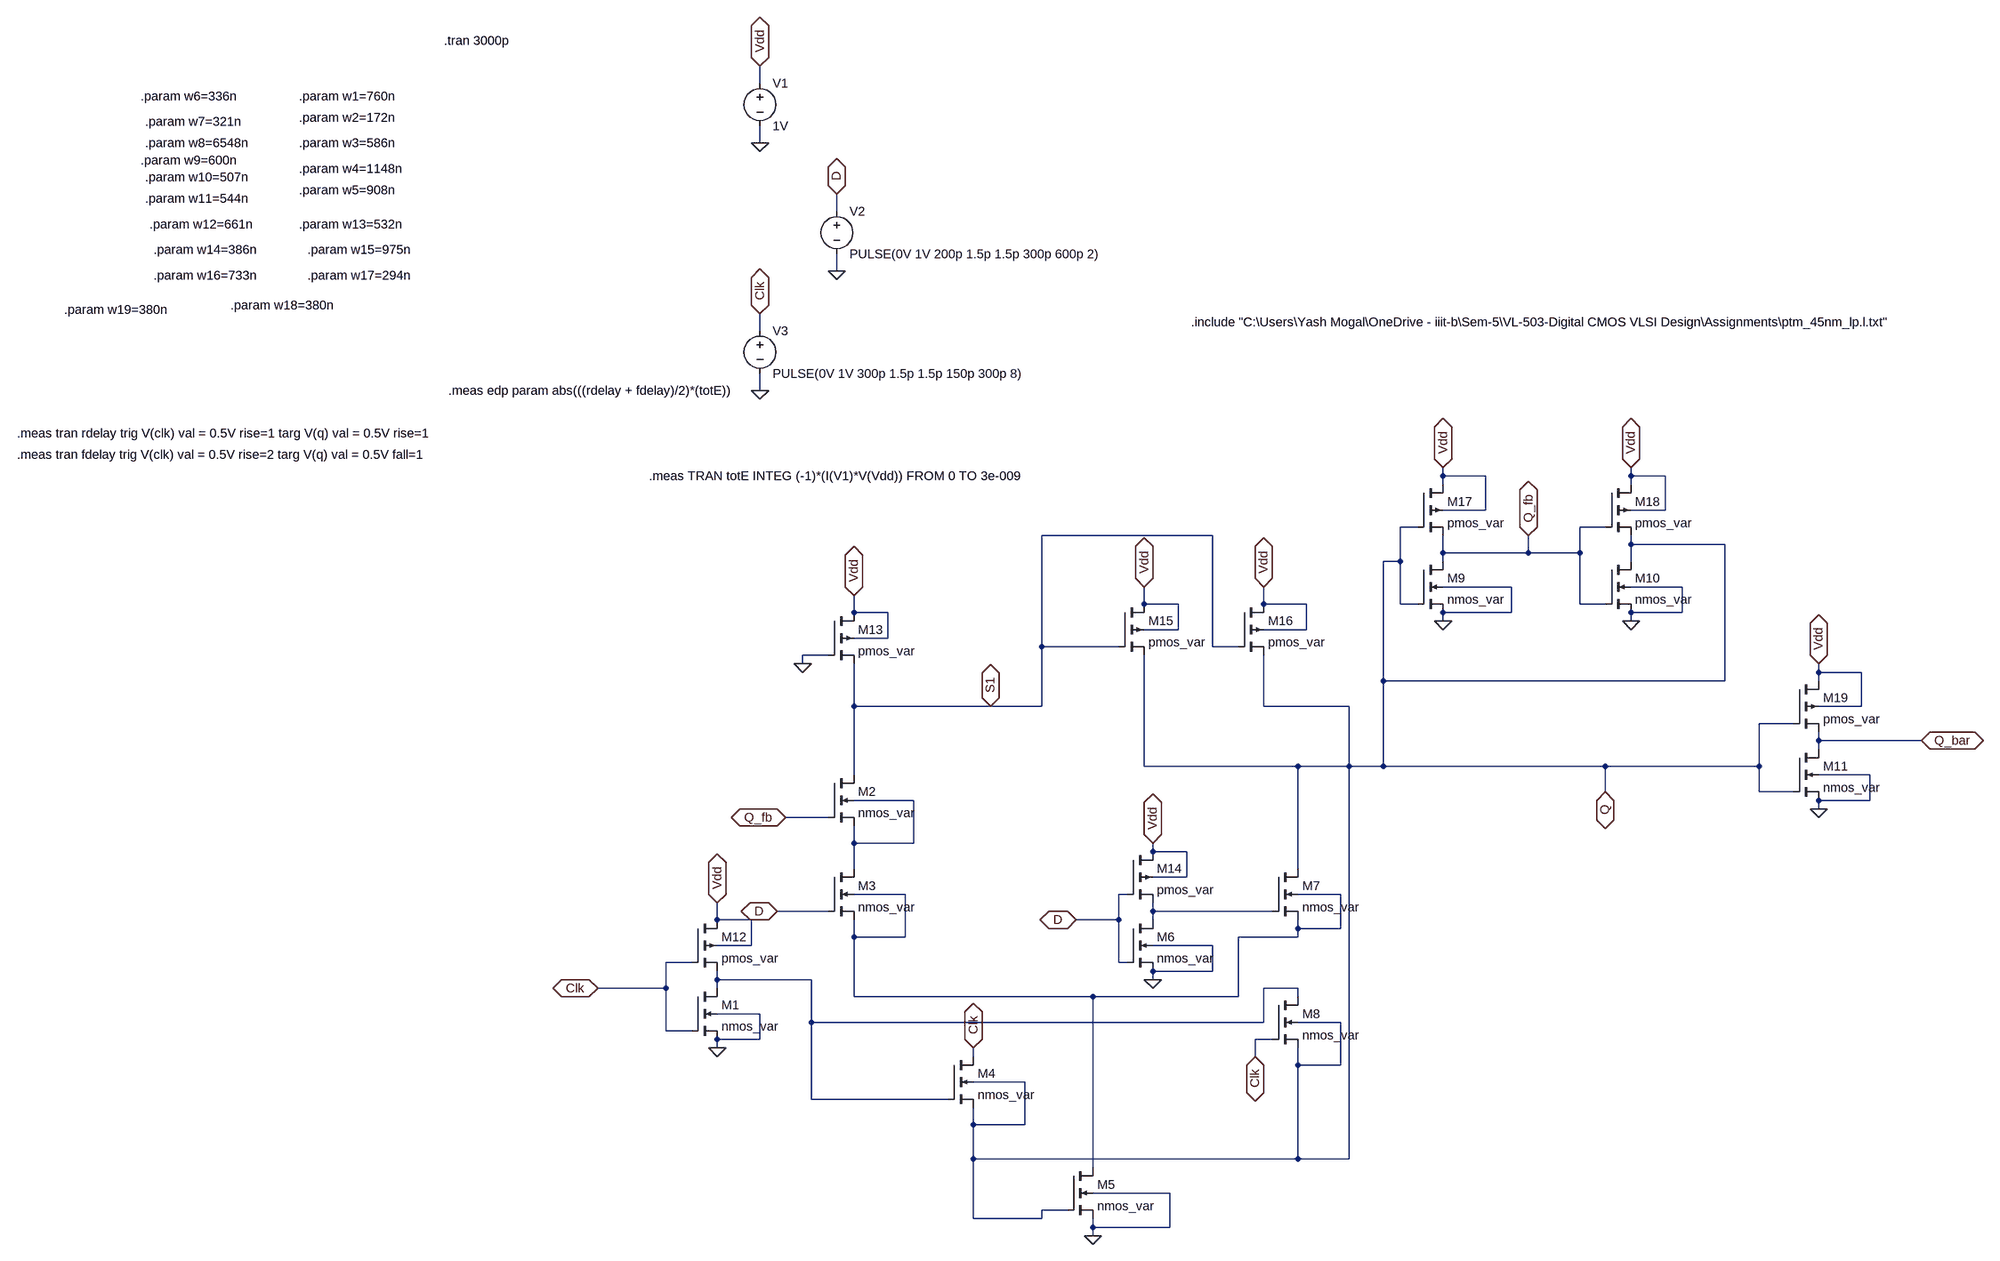
[diagram p0: schematic Project_CEPFF.asc]
Project_CEPFF.asc, the LTspice schematic file:
Version 4
SHEET 1 2164 680
WIRE -144 -1664 -144 -1696
WIRE -144 -1552 -144 -1584
WIRE 0 -1424 0 -1456
WIRE 0 -1312 0 -1344
WIRE -144 -1200 -144 -1232
WIRE -144 -1088 -144 -1120
WIRE 1136 -928 1136 -944
WIRE 1216 -928 1136 -928
WIRE 1488 -928 1488 -944
WIRE 1552 -928 1488 -928
WIRE 1136 -912 1136 -928
WIRE 1488 -912 1488 -928
WIRE 1216 -864 1216 -928
WIRE 1216 -864 1136 -864
WIRE 1552 -864 1552 -928
WIRE 1552 -864 1488 -864
WIRE 1088 -832 1056 -832
WIRE 1440 -832 1392 -832
WIRE 704 -816 384 -816
WIRE 1488 -800 1488 -816
WIRE 1664 -800 1488 -800
WIRE 1136 -784 1136 -816
WIRE 1296 -784 1296 -816
WIRE 1296 -784 1136 -784
WIRE 1392 -784 1392 -832
WIRE 1392 -784 1296 -784
WIRE 1056 -768 1056 -832
WIRE 1056 -768 1024 -768
WIRE 1136 -768 1136 -784
WIRE 1488 -768 1488 -800
WIRE 1264 -720 1136 -720
WIRE 1584 -720 1488 -720
WIRE 576 -688 576 -720
WIRE 640 -688 576 -688
WIRE 800 -688 800 -720
WIRE 880 -688 800 -688
WIRE 1056 -688 1056 -768
WIRE 1088 -688 1056 -688
WIRE 1392 -688 1392 -784
WIRE 1440 -688 1392 -688
WIRE 32 -672 32 -704
WIRE 96 -672 32 -672
WIRE 1264 -672 1264 -720
WIRE 1264 -672 1136 -672
WIRE 1584 -672 1584 -720
WIRE 1584 -672 1488 -672
WIRE 1136 -656 1136 -672
WIRE 1488 -656 1488 -672
WIRE 640 -640 640 -688
WIRE 640 -640 576 -640
WIRE 880 -640 880 -688
WIRE 880 -640 800 -640
WIRE 96 -624 96 -672
WIRE 96 -624 32 -624
WIRE 384 -608 384 -816
WIRE 528 -608 384 -608
WIRE 704 -608 704 -816
WIRE 752 -608 704 -608
WIRE -16 -592 -64 -592
WIRE -64 -576 -64 -592
WIRE 1840 -560 1840 -576
WIRE 1920 -560 1840 -560
WIRE 1024 -544 1024 -768
WIRE 1664 -544 1664 -800
WIRE 1664 -544 1024 -544
WIRE 1840 -544 1840 -560
WIRE 32 -496 32 -576
WIRE 288 -496 32 -496
WIRE 384 -496 384 -608
WIRE 384 -496 288 -496
WIRE 800 -496 800 -592
WIRE 960 -496 800 -496
WIRE 1920 -496 1920 -560
WIRE 1920 -496 1840 -496
WIRE 1792 -464 1728 -464
WIRE 1840 -432 1840 -448
WIRE 2032 -432 1840 -432
WIRE 1840 -416 1840 -432
WIRE 576 -384 576 -592
WIRE 864 -384 576 -384
WIRE 960 -384 960 -496
WIRE 960 -384 864 -384
WIRE 1024 -384 1024 -544
WIRE 1024 -384 960 -384
WIRE 1440 -384 1024 -384
WIRE 1728 -384 1728 -464
WIRE 1728 -384 1440 -384
WIRE 32 -368 32 -496
WIRE 1936 -368 1840 -368
WIRE 1440 -336 1440 -384
WIRE 1728 -336 1728 -384
WIRE 1792 -336 1728 -336
WIRE 144 -320 32 -320
WIRE 1936 -320 1936 -368
WIRE 1936 -320 1840 -320
WIRE 1840 -304 1840 -320
WIRE -16 -288 -96 -288
WIRE 32 -240 32 -272
WIRE 144 -240 144 -320
WIRE 144 -240 32 -240
WIRE 592 -224 592 -240
WIRE 656 -224 592 -224
WIRE 32 -192 32 -240
WIRE 864 -192 864 -384
WIRE 656 -176 656 -224
WIRE 656 -176 592 -176
WIRE 128 -144 32 -144
WIRE 544 -144 528 -144
WIRE 944 -144 864 -144
WIRE -16 -112 -112 -112
WIRE 592 -112 592 -128
WIRE 816 -112 592 -112
WIRE -224 -96 -224 -128
WIRE -160 -96 -224 -96
WIRE 528 -96 528 -144
WIRE 528 -96 448 -96
WIRE 592 -96 592 -112
WIRE 864 -80 864 -96
WIRE 944 -80 944 -144
WIRE 944 -80 864 -80
WIRE 32 -64 32 -96
WIRE 128 -64 128 -144
WIRE 128 -64 32 -64
WIRE 864 -64 864 -80
WIRE 864 -64 752 -64
WIRE -160 -48 -160 -96
WIRE -160 -48 -224 -48
WIRE 704 -48 592 -48
WIRE -272 -16 -320 -16
WIRE 528 -16 528 -96
WIRE 544 -16 528 -16
WIRE 704 0 704 -48
WIRE 704 0 592 0
WIRE -224 16 -224 0
WIRE -48 16 -224 16
WIRE 592 16 592 0
WIRE -320 32 -320 -16
WIRE -320 32 -448 32
WIRE -224 32 -224 16
WIRE 864 32 800 32
WIRE 32 48 32 -64
WIRE 480 48 32 48
WIRE 752 48 752 -64
WIRE 752 48 480 48
WIRE 864 48 864 32
WIRE -144 80 -224 80
WIRE -48 96 -48 16
WIRE 800 96 800 32
WIRE 800 96 -48 96
WIRE 944 96 864 96
WIRE -320 112 -320 32
WIRE -272 112 -320 112
WIRE -144 128 -144 80
WIRE -144 128 -224 128
WIRE 816 128 784 128
WIRE -224 144 -224 128
WIRE 256 160 256 144
WIRE 784 160 784 128
WIRE 864 176 864 144
WIRE 944 176 944 96
WIRE 944 176 864 176
WIRE 352 208 256 208
WIRE -48 240 -48 96
WIRE 208 240 -48 240
WIRE 256 288 256 256
WIRE 352 288 352 208
WIRE 352 288 256 288
WIRE 256 352 256 288
WIRE 864 352 864 176
WIRE 864 352 256 352
WIRE 960 352 960 -384
WIRE 960 352 864 352
WIRE 480 368 480 48
WIRE 624 416 480 416
WIRE 432 448 384 448
WIRE 256 464 256 352
WIRE 384 464 384 448
WIRE 384 464 256 464
WIRE 480 480 480 464
WIRE 624 480 624 416
WIRE 624 480 480 480
WIRE 480 496 480 480
FLAG 32 -704 Vdd
IOPIN 32 -704 BiDir
FLAG 576 -720 Vdd
IOPIN 576 -720 BiDir
FLAG 800 -720 Vdd
IOPIN 800 -720 BiDir
FLAG 1136 -944 Vdd
IOPIN 1136 -944 BiDir
FLAG 1488 -944 Vdd
IOPIN 1488 -944 BiDir
FLAG 1840 -576 Vdd
IOPIN 1840 -576 BiDir
FLAG 592 -240 Vdd
IOPIN 592 -240 BiDir
FLAG -224 -128 Vdd
IOPIN -224 -128 BiDir
FLAG -224 144 0
FLAG 480 496 0
FLAG 592 16 0
FLAG 1840 -304 0
FLAG 1136 -656 0
FLAG 1488 -656 0
FLAG 256 144 Clk
IOPIN 256 144 BiDir
FLAG 784 160 Clk
IOPIN 784 160 BiDir
FLAG -448 32 Clk
IOPIN -448 32 BiDir
FLAG -64 -576 0
FLAG -112 -112 D
IOPIN -112 -112 BiDir
FLAG 448 -96 D
IOPIN 448 -96 BiDir
FLAG -96 -288 Q_fb
IOPIN -96 -288 BiDir
FLAG 1296 -816 Q_fb
IOPIN 1296 -816 BiDir
FLAG 1440 -336 Q
IOPIN 1440 -336 BiDir
FLAG 2032 -432 Q_bar
IOPIN 2032 -432 BiDir
FLAG 288 -496 S1
IOPIN 288 -496 BiDir
FLAG -144 -1552 0
FLAG 0 -1312 0
FLAG -144 -1088 0
FLAG -144 -1696 Vdd
IOPIN -144 -1696 BiDir
FLAG 0 -1456 D
IOPIN 0 -1456 BiDir
FLAG -144 -1232 Clk
IOPIN -144 -1232 BiDir
SYMBOL nmos4 -272 32 R0
SYMATTR InstName M1
SYMATTR Value nmos_var
SYMATTR Value2 l=45nm w=w5
SYMBOL nmos4 -16 -368 R0
SYMATTR InstName M2
SYMATTR Value nmos_var
SYMATTR Value2 l=45nm w=w2
SYMBOL nmos4 -16 -192 R0
SYMATTR InstName M3
SYMATTR Value nmos_var
SYMATTR Value2 l=45nm w=w3
SYMBOL nmos4 208 160 R0
SYMATTR InstName M4
SYMATTR Value nmos_var
SYMATTR Value2 l=45nm w=w6
SYMBOL nmos4 432 368 R0
SYMATTR InstName M5
SYMATTR Value nmos_var
SYMATTR Value2 l=45nm w=w7
SYMBOL nmos4 544 -96 R0
SYMATTR InstName M6
SYMATTR Value nmos_var
SYMATTR Value2 l=45nm w=w10
SYMBOL nmos4 816 -192 R0
SYMATTR InstName M7
SYMATTR Value nmos_var
SYMATTR Value2 l=45nm w=w11
SYMBOL nmos4 816 48 R0
SYMATTR InstName M8
SYMATTR Value nmos_var
SYMATTR Value2 l=45nm w=w8
SYMBOL nmos4 1088 -768 R0
SYMATTR InstName M9
SYMATTR Value nmos_var
SYMATTR Value2 l=45nm w=w15
SYMBOL nmos4 1440 -768 R0
SYMATTR InstName M10
SYMATTR Value nmos_var
SYMATTR Value2 l=45nm w=w17
SYMBOL nmos4 1792 -416 R0
SYMATTR InstName M11
SYMATTR Value nmos_var
SYMATTR Value2 l=45nm w=w19
SYMBOL pmos4 -272 -96 R0
SYMATTR InstName M12
SYMATTR Value pmos_var
SYMATTR Value2 l=45nm w=w4
SYMBOL pmos4 -16 -672 R0
SYMATTR InstName M13
SYMATTR Value pmos_var
SYMATTR Value2 l=45nm w=w1
SYMBOL pmos4 544 -224 R0
SYMATTR InstName M14
SYMATTR Value pmos_var
SYMATTR Value2 l=45nm w=w9
SYMBOL pmos4 528 -688 R0
SYMATTR InstName M15
SYMATTR Value pmos_var
SYMATTR Value2 l=45nm w=w12
SYMBOL pmos4 752 -688 R0
SYMATTR InstName M16
SYMATTR Value pmos_var
SYMATTR Value2 l=45nm w=w13
SYMBOL pmos4 1088 -912 R0
SYMATTR InstName M17
SYMATTR Value pmos_var
SYMATTR Value2 l=45nm w=w14
SYMBOL pmos4 1440 -912 R0
SYMATTR InstName M18
SYMATTR Value pmos_var
SYMATTR Value2 l=45nm w=w16
SYMBOL pmos4 1792 -544 R0
SYMATTR InstName M19
SYMATTR Value pmos_var
SYMATTR Value2 l=45nm w=w18
SYMBOL voltage -144 -1680 R0
WINDOW 123 0 0 Left 0
WINDOW 39 0 0 Left 0
SYMATTR InstName V1
SYMATTR Value 1V
SYMBOL voltage 0 -1440 R0
WINDOW 123 0 0 Left 0
WINDOW 39 0 0 Left 0
SYMATTR InstName V2
SYMATTR Value PULSE(0V 1V 200p 1.5p 1.5p 300p 600p 2)
SYMBOL voltage -144 -1216 R0
WINDOW 123 0 0 Left 0
WINDOW 39 0 0 Left 0
SYMATTR InstName V3
SYMATTR Value PULSE(0V 1V 300p 1.5p 1.5p 150p 300p 8)
TEXT -352 -928 Left 2 !.meas TRAN totE INTEG (-1)*(I(V1)*V(Vdd)) FROM 0 TO 3e-009
TEXT -1008 -1640 Left 2 !.param w1=760n
TEXT -1008 -1600 Left 2 !.param w2=172n
TEXT -1008 -1552 Left 2 !.param w3=586n
TEXT -1008 -1504 Left 2 !.param w4=1148n
TEXT -1008 -1464 Left 2 !.param w5=908n
TEXT -1304 -1640 Left 2 !.param w6=336n
TEXT -1296 -1592 Left 2 !.param w7=321n
TEXT -1296 -1552 Left 2 !.param w8=6548n
TEXT -1304 -1520 Left 2 !.param w9=600n
TEXT -1296 -1488 Left 2 !.param w10=507n
TEXT -1296 -1448 Left 2 !.param w11=544n
TEXT -1288 -1400 Left 2 !.param w12=661n
TEXT -1008 -1400 Left 2 !.param w13=532n
TEXT -1280 -1352 Left 2 !.param w14=386n
TEXT -992 -1352 Left 2 !.param w15=975n
TEXT -1280 -1304 Left 2 !.param w16=733n
TEXT -992 -1304 Left 2 !.param w17=294n
TEXT -1136 -1248 Left 2 !.param w18=380n
TEXT -728 -1088 Left 2 !.meas edp param abs(((rdelay + fdelay)/2)*(totE))
TEXT -736 -1744 Left 2 !.tran 3000p
TEXT -1448 -1240 Left 2 !.param w19=380n
TEXT -1536 -1008 Left 2 !.meas tran rdelay trig V(clk) val = 0.5V rise=1 targ V(q) val = 0.5V rise=1
TEXT -1536 -968 Left 2 !.meas tran fdelay trig V(clk) val = 0.5V rise=2 targ V(q) val = 0.5V fall=1
TEXT 664 -1216 Left 2 !.include "C:\\Users\\Yash Mogal\\OneDrive - iiit-b\\Sem-5\\VL-503-Digital CMOS VLSI Design\\Assignments\\ptm_45nm_lp.l.txt"

The netlist it stands for:
* Project_CEPFF.asc
M1 N004 Clk 0 0 nmos_var l=45nm w=w5
M2 S1 Q_fb N001 N001 nmos_var l=45nm w=w2
M3 N001 D N002 N002 nmos_var l=45nm w=w3
M4 Clk N004 Q Q nmos_var l=45nm w=w6
M5 N002 Q 0 0 nmos_var l=45nm w=w7
M6 N003 D 0 0 nmos_var l=45nm w=w10
M7 Q N003 N002 N002 nmos_var l=45nm w=w11
M8 N004 Clk Q Q nmos_var l=45nm w=w8
M9 Q_fb Q 0 0 nmos_var l=45nm w=w15
M10 Q Q_fb 0 0 nmos_var l=45nm w=w17
M11 Q_bar Q 0 0 nmos_var l=45nm w=w19
M12 Vdd Clk N004 Vdd pmos_var l=45nm w=w4
M13 Vdd 0 S1 Vdd pmos_var l=45nm w=w1
M14 Vdd D N003 Vdd pmos_var l=45nm w=w9
M15 Vdd S1 Q Vdd pmos_var l=45nm w=w12
M16 Vdd S1 Q Vdd pmos_var l=45nm w=w13
M17 Vdd Q Q_fb Vdd pmos_var l=45nm w=w14
M18 Vdd Q_fb Q Vdd pmos_var l=45nm w=w16
M19 Vdd Q Q_bar Vdd pmos_var l=45nm w=w18
V1 Vdd 0 1V
V2 D 0 PULSE(0V 1V 200p 1.5p 1.5p 300p 600p 2)
V3 Clk 0 PULSE(0V 1V 300p 1.5p 1.5p 150p 300p 8)
.model NMOS NMOS
.model PMOS PMOS
.lib standard.mos
.meas TRAN totE INTEG (-1)*(I(V1)*V(Vdd)) FROM 0 TO 3e-009
.param w1=760n
.param w2=172n
.param w3=586n
.param w4=1148n
.param w5=908n
.param w6=336n
.param w7=321n
.param w8=6548n
.param w9=600n
.param w10=507n
.param w11=544n
.param w12=661n
.param w13=532n
.param w14=386n
.param w15=975n
.param w16=733n
.param w17=294n
.param w18=380n
.meas edp param abs(((rdelay + fdelay)/2)*(totE))
.tran 3000p
.param w19=380n
.meas tran rdelay trig V(clk) val = 0.5V rise=1 targ V(q) val = 0.5V rise=1
.meas tran fdelay trig V(clk) val = 0.5V rise=2 targ V(q) val = 0.5V fall=1
.include "C:\Users\Yash Mogal\OneDrive - iiit-b\Sem-5\VL-503-Digital CMOS VLSI Design\Assignments\ptm_45nm_lp.l.txt"
.backanno
.end